# Altium schematic sheet JS7628_base_interface_v1.0.SchDoc
size A4
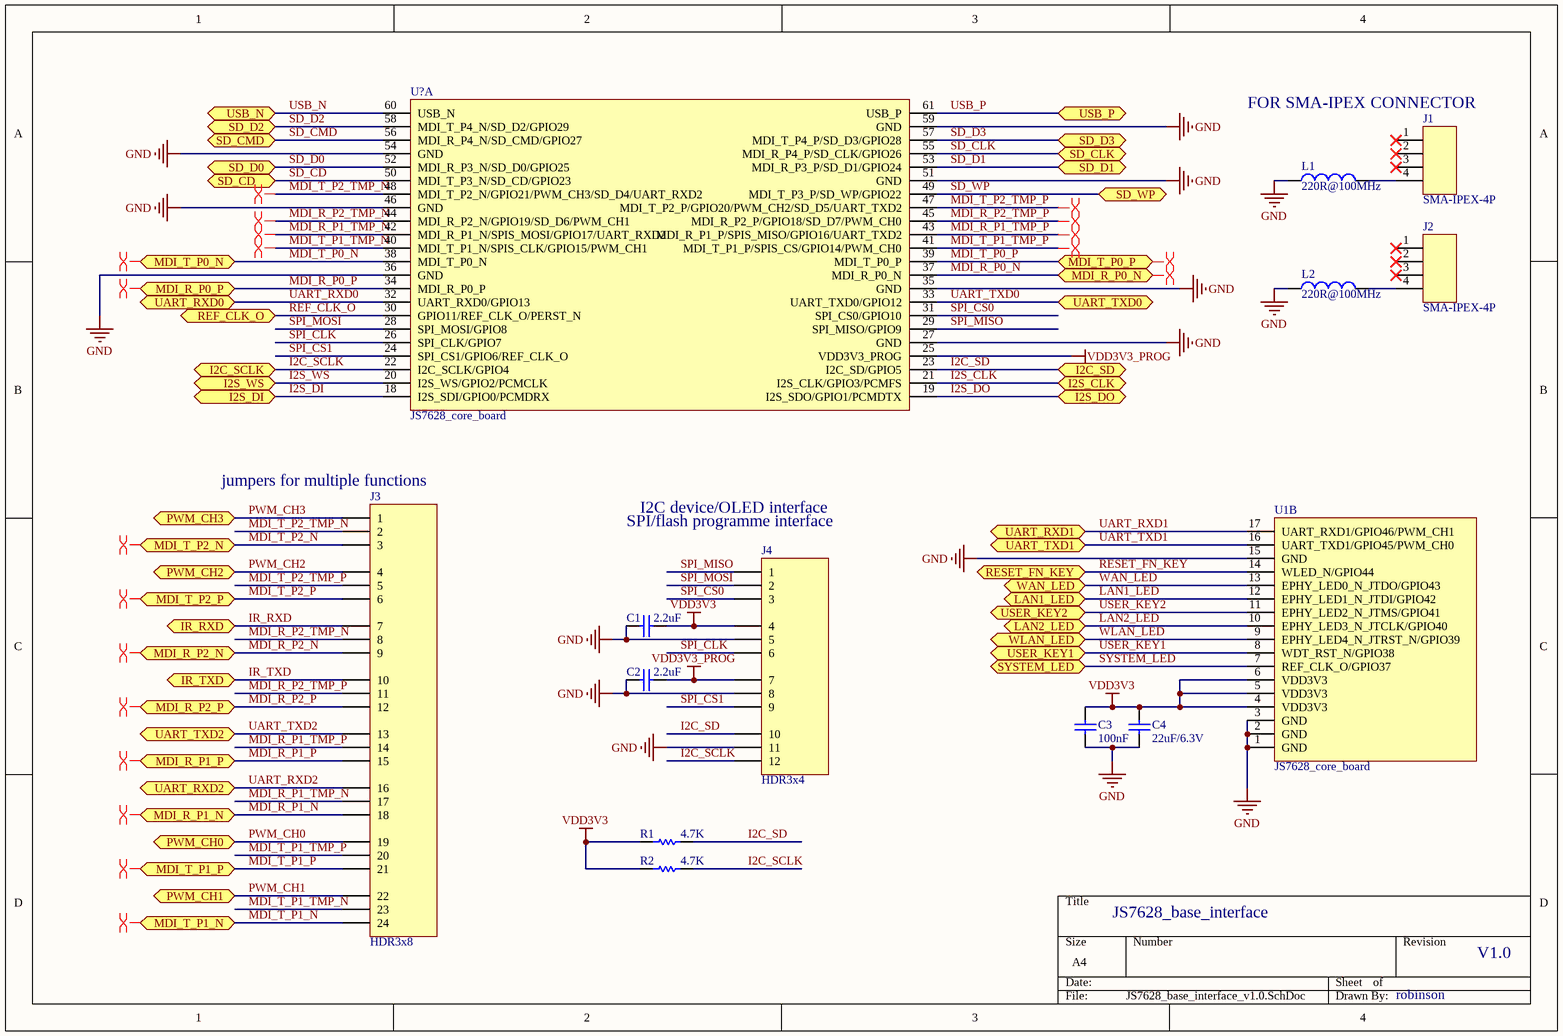
[diagram p0: JS7628_base_interface_v1.0.SchDoc]

## Parts
C1  value 2.2uF  [0603]  (hidden comment: CAP-SMT)
C2  value 2.2uF  [0603]  (hidden comment: CAP-SMT)
C3  value 100nF  [0603]  (hidden comment: CAP-SMT)
C4  value 22uF/6.3V  [0603]  (hidden comment: CAP-SMT)
J1  SMA-IPEX-4P  [SMA-4P]
J2  SMA-IPEX-4P  [SMA-4P]
J3  HDR3x8  [HDR3X8-2.54mm]
J4  HDR3x4  [HDR3X4-2.54MM]
L1  value 220R@100MHz  [0603]  (hidden comment: inductor)
L2  value 220R@100MHz  [0603]  (hidden comment: inductor)
R1  value 4.7K  [0603]  (hidden comment: RES-SMT)
R2  value 4.7K  [0603]  (hidden comment: RES-SMT)
U1  JS7628_core_board  [JS7628_core_board]  (part B of 2)
U?  JS7628_core_board  [JS7628_core_board]  (part A of 2)

## Ports
I2C_SCLK, I2C_SD, I2S_CLK, I2S_DI, I2S_DO, I2S_WS, IR_RXD, IR_TXD, LAN1_LED, LAN2_LED, MDI_R_P0_N, MDI_R_P0_P, MDI_R_P1_N, MDI_R_P1_P, MDI_R_P2_N, MDI_R_P2_P, MDI_T_P0_N, MDI_T_P0_P, MDI_T_P1_N, MDI_T_P1_P, MDI_T_P2_N, MDI_T_P2_P, PWM_CH0, PWM_CH1, PWM_CH2, PWM_CH3, REF_CLK_O, RESET_FN_KEY, SD_CD, SD_CLK, SD_CMD, SD_D0, SD_D1, SD_D2, SD_D3, SD_WP, SYSTEM_LED, UART_RXD0, UART_RXD1, UART_RXD2, UART_TXD0, UART_TXD1, UART_TXD2, USB_N, USB_P, USER_KEY1, USER_KEY2, WAN_LED, WLAN_LED

## Nets
GND: C1.2 C2.2 C3.1 C4.1 J4.5 J4.8 J4.11 L1.1 L2.1 U1.1(GND) U1.2(GND) U1.3(GND) U1.15(GND) U?.27(GND) U?.35(GND) U?.36(GND) U?.46(GND) U?.51(GND) U?.54(GND) U?.59(GND)
VDD3V3: C1.1 C3.2 C4.2 J4.4 R1.2 R2.2 U1.4(VDD3V3) U1.5(VDD3V3) U1.6(VDD3V3)
VDD3V3_PROG: C2.1 J4.7 U?.25(VDD3V3_PROG)
I2C_SCLK: J4.12 R2.1 U?.22(I2C_SCLK/GPIO4) ; port I2C_SCLK
I2C_SD: J4.10 R1.1 U?.23(I2C_SD/GPIO5) ; port I2C_SD
I2S_CLK: U?.21(I2S_CLK/GPIO3/PCMFS) ; port I2S_CLK
I2S_DI: U?.18(I2S_SDI/GPIO0/PCMDRX) ; port I2S_DI
I2S_DO: U?.19(I2S_SDO/GPIO1/PCMDTX) ; port I2S_DO
I2S_WS: U?.20(I2S_WS/GPIO2/PCMCLK) ; port I2S_WS
IR_RXD: J3.7 ; port IR_RXD
IR_TXD: J3.10 ; port IR_TXD
LAN1_LED: U1.12(EPHY_LED1_N_JTDI/GPIO42) ; port LAN1_LED
LAN2_LED: U1.10(EPHY_LED3_N_JTCLK/GPIO40) ; port LAN2_LED
MDI_R_P0_N: U?.37(MDI_R_P0_N) ; port MDI_R_P0_N
MDI_R_P0_P: U?.34(MDI_R_P0_P) ; port MDI_R_P0_P
MDI_R_P1_N: J3.18 ; port MDI_R_P1_N
MDI_R_P1_P: J3.15 ; port MDI_R_P1_P
MDI_R_P1_TMP_N: J3.17 U?.42(MDI_R_P1_N/SPIS_MOSI/GPIO17/UART_RXD2)
MDI_R_P1_TMP_P: J3.14 U?.43(MDI_R_P1_P/SPIS_MISO/GPIO16/UART_TXD2)
MDI_R_P2_N: J3.9 ; port MDI_R_P2_N
MDI_R_P2_P: J3.12 ; port MDI_R_P2_P
MDI_R_P2_TMP_N: J3.8 U?.44(MDI_R_P2_N/GPIO19/SD_D6/PWM_CH1)
MDI_R_P2_TMP_P: J3.11 U?.45(MDI_R_P2_P/GPIO18/SD_D7/PWM_CH0)
MDI_T_P0_N: U?.38(MDI_T_P0_N) ; port MDI_T_P0_N
MDI_T_P0_P: U?.39(MDI_T_P0_P) ; port MDI_T_P0_P
MDI_T_P1_N: J3.24 ; port MDI_T_P1_N
MDI_T_P1_P: J3.21 ; port MDI_T_P1_P
MDI_T_P1_TMP_N: J3.23 U?.40(MDI_T_P1_N/SPIS_CLK/GPIO15/PWM_CH1)
MDI_T_P1_TMP_P: J3.20 U?.41(MDI_T_P1_P/SPIS_CS/GPIO14/PWM_CH0)
MDI_T_P2_N: J3.3 ; port MDI_T_P2_N
MDI_T_P2_P: J3.6 ; port MDI_T_P2_P
MDI_T_P2_TMP_N: J3.2 U?.48(MDI_T_P2_N/GPIO21/PWM_CH3/SD_D4/UART_RXD2)
MDI_T_P2_TMP_P: J3.5 U?.47(MDI_T_P2_P/GPIO20/PWM_CH2/SD_D5/UART_TXD2)
PWM_CH0: J3.19 ; port PWM_CH0
PWM_CH1: J3.22 ; port PWM_CH1
PWM_CH2: J3.4 ; port PWM_CH2
PWM_CH3: J3.1 ; port PWM_CH3
REF_CLK_O: U?.30(GPIO11/REF_CLK_O/PERST_N) ; port REF_CLK_O
RESET_FN_KEY: U1.14(WLED_N/GPIO44) ; port RESET_FN_KEY
SD_CD: U?.50(MDI_T_P3_N/SD_CD/GPIO23) ; port SD_CD
SD_CLK: U?.55(MDI_R_P4_P/SD_CLK/GPIO26) ; port SD_CLK
SD_CMD: U?.56(MDI_R_P4_N/SD_CMD/GPIO27) ; port SD_CMD
SD_D0: U?.52(MDI_R_P3_N/SD_D0/GPIO25) ; port SD_D0
SD_D1: U?.53(MDI_R_P3_P/SD_D1/GPIO24) ; port SD_D1
SD_D2: U?.58(MDI_T_P4_N/SD_D2/GPIO29) ; port SD_D2
SD_D3: U?.57(MDI_T_P4_P/SD_D3/GPIO28) ; port SD_D3
SD_WP: U?.49(MDI_T_P3_P/SD_WP/GPIO22) ; port SD_WP
SPI_CLK: J4.6 U?.26(SPI_CLK/GPIO7)
SPI_CS0: J4.3 U?.31(SPI_CS0/GPIO10)
SPI_CS1: J4.9 U?.24(SPI_CS1/GPIO6/REF_CLK_O)
SPI_MISO: J4.1 U?.29(SPI_MISO/GPIO9)
SPI_MOSI: J4.2 U?.28(SPI_MOSI/GPIO8)
SYSTEM_LED: U1.7(REF_CLK_O/GPIO37) ; port SYSTEM_LED
UART_RXD0: U?.32(UART_RXD0/GPIO13) ; port UART_RXD0
UART_RXD1: U1.17(UART_RXD1/GPIO46/PWM_CH1) ; port UART_RXD1
UART_RXD2: J3.16 ; port UART_RXD2
UART_TXD0: U?.33(UART_TXD0/GPIO12) ; port UART_TXD0
UART_TXD1: U1.16(UART_TXD1/GPIO45/PWM_CH0) ; port UART_TXD1
UART_TXD2: J3.13 ; port UART_TXD2
USB_N: U?.60(USB_N) ; port USB_N
USB_P: U?.61(USB_P) ; port USB_P
USER_KEY1: U1.8(WDT_RST_N/GPIO38) ; port USER_KEY1
USER_KEY2: U1.11(EPHY_LED2_N_JTMS/GPIO41) ; port USER_KEY2
WAN_LED: U1.13(EPHY_LED0_N_JTDO/GPIO43) ; port WAN_LED
WLAN_LED: U1.9(EPHY_LED4_N_JTRST_N/GPIO39) ; port WLAN_LED
NetJ1_4: J1.4 L1.2
NetJ2_4: J2.4 L2.2

Not connected (* = marked no-connect by the designer): J1 1* 2* 3*; J2 1* 2* 3*

## Layout directives
differential pair: MDI_R_P0_N, MDI_R_P0_P, MDI_R_P1_N, MDI_R_P1_P, MDI_R_P1_TMP_N, MDI_R_P1_TMP_P, MDI_R_P2_N, MDI_R_P2_P, MDI_R_P2_TMP_N, MDI_R_P2_TMP_P, MDI_T_P0_N, MDI_T_P0_P, MDI_T_P1_N, MDI_T_P1_P, MDI_T_P1_TMP_N, MDI_T_P1_TMP_P, MDI_T_P2_N, MDI_T_P2_P, MDI_T_P2_TMP_N, MDI_T_P2_TMP_P

## Notes on the sheet
- (near J1) FOR SMA-IPEX CONNECTOR
- (near J3) jumpers for multiple functions
- I2C device/OLED interface
- (near J4) SPI/flash programme interface
- JS7628_base_interface
- V1.0
- robinson